# EAGLE design MTRduino_rev5.2 (EAGLE 7.2.0)
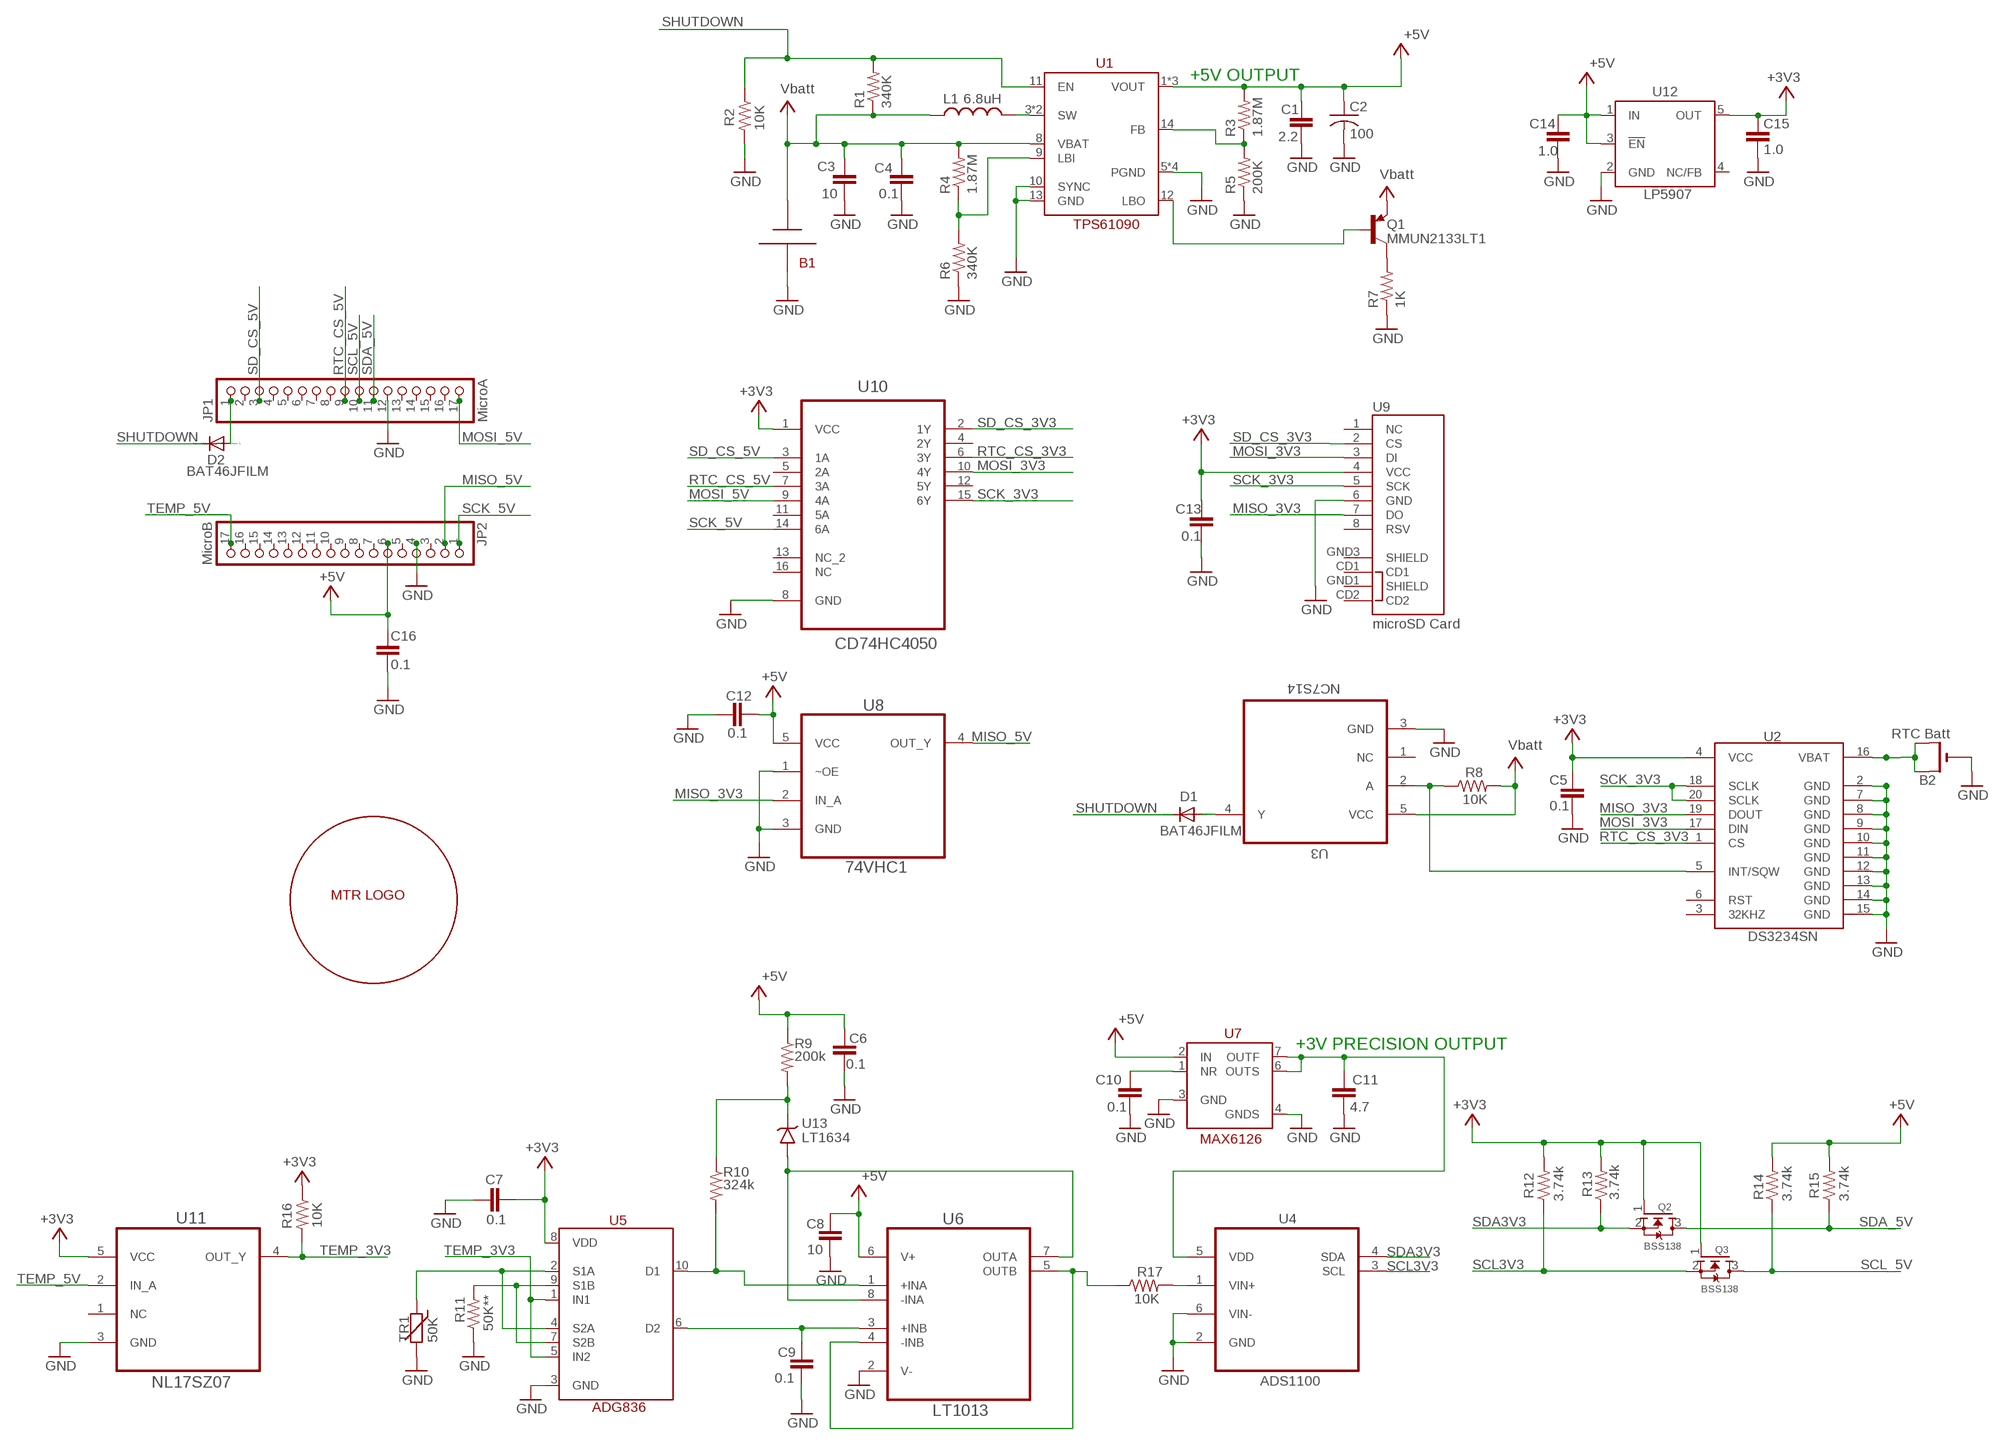
[diagram p0: schematic, sheet 1]

## Parts
B1  2x AA BATT  BATT_AA2  [BATT_AA2]
B2  RTC Batt  CR1220SMT  [CR1220-SMD]
C1  2.2  C-EUC0603  [C0603]
C2  100  C-USC1206K  [C1206K]
C3  10  C-EUC0603  [C0603]
C4  0.1  C-EUC0603  [C0603]
C5  0.1  C-EUC0603  [C0603]
C6  0.1  C-EUC0603  [C0603]
C7  0.1  C-EUC0603  [C0603]
C8  10  C-EUC0603  [C0603]
C9  0.1  C-EUC0603  [C0603]
C10  0.1  C-EUC0603  [C0603]
C11  4.7  C-EUC0603  [C0603]
C12  0.1  C-EUC0603  [C0603]
C13  0.1  C-EUC0603  [C0603]
C14  1.0  C-EUC0603  [C0603]
C15  1.0  C-EUC0603  [C0603]
C16  0.1  C-EUC0603  [C0603]
D1  BAT46JFILM  DIODE-SOD323-R  [SOD323-R]
D2  BAT46JFILM  DIODE-SOD323-R  [SOD323-R]
JP1  MicroA  PINHD-1X17  [1X17]
JP2  MicroB  PINHD-1X17  [1X17]
L1  6.8uH  L-USVLC6045  [VLC6045]
Q1  MMUN2133LT1  MMUN2111LT1  [SC59-BEC]
Q2  BSS138  MOSFET-NREFLOW  [SOT23]
Q3  BSS138  MOSFET-NREFLOW  [SOT23]
R1  340K  R-US_R0603  [R0603]
R2  10K  R-US_R0603  [R0603]
R3  1.87M  R-US_R0805  [R0805]
R4  1.87M  R-US_R0805  [R0805]
R5  200K  R-US_R0603  [R0603]
R6  340K  R-US_R0603  [R0603]
R7  1K  R-US_R0603  [R0603]
R8  10K  R-US_R0603  [R0603]
R9  200k  R-US_R1206  [R1206]
R10  324k  R-US_R1206  [R1206]
R11  50K**  R-US_R2010  [R2010]
R12  3.74k  R-US_R0603  [R0603]
R13  3.74k  R-US_R0603  [R0603]
R14  3.74k  R-US_R0603  [R0603]
R15  3.74k  R-US_R0603  [R0603]
R16  10K  R-US_R0603  [R0603]
R17  10K  R-US_R0603  [R0603]
TR1  50K  THERMISTOR_R-5  [R-5]
U1  TPS61090  TPS61090RSAR  [QFN16-4X4]
U2  DS3234SN  DS3234  [DS3234]
U3  NC7S14  1P1G14MDBVREPG4  [SOT95P280X145-5N]
U4  ADS1100  ADS1100A0IDBVT  [SOT95P280X145-6N]
U5  ADG836  [MSOP10]
U6  LT1013  LT1013DS8PBF  [SOIC127P600X175-8N]
U7  MAX6126  [SOIC127P600X175-8N]
U8  74VHC1  M74VHC1GT125DF1G  [SOT65P210X110-5N]
U9  microSD Card  USD-SOCKET  [MICROSD_1:1]
U10  CD74HC4050  M74HC4050RM13TR  [SOIC127P600X175-16N]
U11  NL17SZ07  NL17SZ07DFT2G  [SOT65P210X110-5N]
U12  LP5907  TPS77030  [SOT23-DBV]
U13  LT1634  LT1634BIS8-1.25  [S8]
U$1  MTRLOGO  [MTRLOGO]

## Nets
+3V3: C5.1 C7.2 C13.1 C15.1 Q2.1(G) Q3.1(G) R12.2 R13.2 R16.1 U2.4(VCC) U5.8(VDD) U9.4(VCC) U10.1(VCC) U11.5(VCC) U12.5(OUT)
+5V: C1.1 C2.1 C6.2 C8.2 C12.1 C14.1 C16.1 JP2.6 R3.2 R9.1 R14.2 R15.2 U1.1(VOUT) U1.15(VOUT) U1.16(VOUT) U6.6(V+) U7.2(IN) U8.5(VCC) U12.1(IN) U12.3(!EN)
GND: B1.-(+) B2.- C1.2 C2.2 C3.2 C4.2 C5.2 C6.1 C7.1 C8.1 C9.1 C10.2 C11.2 C12.2 C13.2 C14.2 C15.2 C16.2 JP1.12 JP2.4 R2.2 R5.1 R6.1 R7.1 R11.1 TR1.2 U1.5(PGND) U1.6(PGND) U1.7(PGND) U1.10(SYNC) U1.13(GND) U1.EXP(PGND) U2.2(GND) U2.7(GND) U2.8(GND) U2.9(GND) U2.10(GND) U2.11(GND) U2.12(GND) U2.13(GND) U2.14(GND) U2.15(GND) U3.3(GND) U4.2(GND) U4.6(VIN-) U5.3(GND) U6.2(V-) U7.3(GND) U7.4(GNDS) U8.1(~OE) U8.3(GND) U9.6(GND) U10.8(GND) U11.3(GND) U12.2(GND)
MISO_3V3: U2.19(DOUT) U8.2(IN_A) U9.7(DO)
MISO_5V: JP2.2 U8.4(OUT_Y)
MOSI_3V3: U2.17(DIN) U9.3(DI) U10.10(4Y)
MOSI_5V: JP1.17 U10.9(4A)
N$1: D1.A U3.4(Y)
N$2: C9.2 U5.6(D2) U6.3(+INB)
N$3: R17.2 U4.1(VIN+)
N$4: C10.1 U7.1(NR)
N$5: R17.1 U6.4(-INB) U6.5(OUTB)
N$6: B2.+$1(+) B2.+$2(+1) U2.16(VBAT)
N$7: L1.P$3 U1.3(SW) U1.4(SW)
N$8: R9.2 R10.1 U13.6(VOUT)
N$9: TR1.1 U5.2(S1A) U5.4(S2A)
N$10: R11.2 U5.7(S2B) U5.9(S1B)
N$11: R4.1 R6.2 U1.9(LBI)
N$12: Q1.C R7.2
N$13: R3.1 R5.2 U1.14(FB)
N$14: U6.7(OUTA) U6.8(-INA) U13.4(GND)
N$16: R10.2 U5.10(D1) U6.1(+INA)
N$17: R8.1 U2.5(INT/SQW) U3.2(A)
N$19: Q1.B U1.12(LBO)
N$21: D2.A JP1.1
N$38: C11.1 U4.5(VDD) U7.6(OUTS) U7.7(OUTF)
RTC_CS_3V3: U2.1(CS) U10.6(3Y)
RTC_CS_5V: JP1.9 U10.7(3A)
SCK_3V3: U2.18(SCLK) U2.20(SCLK) U9.5(SCK) U10.15(6Y)
SCK_5V: JP2.1 U10.14(6A)
SCL3V3: Q3.2(S) R12.1 U4.3(SCL)
SCL_5V: JP1.10 Q3.3(D) R14.1
SD_CS_3V3: U9.2(CS) U10.2(1Y)
SD_CS_5V: JP1.3 U10.3(1A)
SDA3V3: Q2.2(S) R13.1 U4.4(SDA)
SDA_5V: JP1.11 Q2.3(D) R15.1
SHUTDOWN: D1.C D2.C R1.2 R2.1 U1.11(EN)
TEMP_3V3: R16.2 U5.1(IN1) U5.5(IN2) U11.4(OUT_Y)
TEMP_5V: JP2.17 U11.2(IN_A)
V+: B1.+(-) C3.1 C4.1 L1.P$2 Q1.E R1.1 R4.2 R8.2 U1.8(VBAT) U3.5(VCC) ; supply symbol labelled Vbatt
Unconnected: JP1.2 JP1.4 JP1.5 JP1.6 JP1.7 JP1.8 JP1.13 JP1.14 JP1.15 JP1.16 JP2.3 JP2.5 JP2.7 JP2.8 JP2.9 JP2.10 JP2.11 JP2.12 JP2.13 JP2.14 JP2.15 JP2.16 U2.3(32KHZ) U2.6(RST) U3.1(NC) U9.1(NC) U9.8(RSV) U9.CD1 U9.CD2 U9.GND1(SHIELD) U9.GND3(SHIELD) U10.4(2Y) U10.5(2A) U10.11(5A) U10.12(5Y) U10.13(NC_2) U10.16(NC) U11.1(NC) U12.4(NC/FB)

## Notes on the sheet
- +5V OUTPUT
- +3V PRECISION OUTPUT

## Library data of the parts
B1 = adafruit:BATT_AA2
B2 = adafruit:CR1220: CR1216/CR1220/CR1225 12mm 3V lithium coin cell Great for battery packup. Both SMT and THM holders. Note the THM package has the ground pads on both sides of the PCB so that the masks are the same - this reduces the cost
C1 C3-C16 = rcl:C-EU: CAPACITOR, European symbol
C2 = resistor:C-US: CAPACITOR, American symbol
D1 D2 = diode:DIODE-: DIODE
JP1 JP2 = pinhead:PINHD-1X17: PIN HEADER
L1 = resistor:L-US: INDUCTOR, American symbol
Q1 = transistor-pnp:MMUN2111*: PNP Transistror
Q2 Q3 = adafruit:MOSFET-N: N-Channel Mosfet 2N7002E - 60V 260mA SOT23 [Digikey: 2N7002ET1GOSTR-ND] - REEL BSH103 - 30V 850mA SOT23 [Digikey: 568-5013-1-ND]
R1-R17 = resistor:R-US_: RESISTOR, American symbol
TR1 = discrete:THERMISTOR_: Thermo Resistor
U1 = microchip:TPS61090RSAR
U2 = SparkFun-FreqCtrl:DS3234: SPI RTC module with battery backup and internal clock.
U3 = Texas Instruments_By_element14_Batch_1:1P1G14MDBVREPG4: SINGLE SCHMITT-TRIGGER INVERTER; MPN: 1P1G14MDBVREPG4; OC_FARNELL: -; OC_NEWARK: 56P2415; PACKAGE: SOT-23-5; SUPPLIER: Texas Instruments
U4 = Texas Instruments_By_element14_Batch_1:ADS1100A0IDBVT: Self-Calibrating, 16-Bit ANALOG-TO-DIGITAL CONVERTER; MPN: ADS1100A0IDBVT; OC_FARNELL: 1135959; OC_NEWARK: 20H0708; PACKAGE: SOT-23-6; SUPPLIER: Texas Instruments
U5 = analog-devices:ADG836
U6 = LTC_By_element14_Batch_1:LT1013DS8PBF: Dual Precision Op Amp; MPN: LT1013DS8#PBF; OC_FARNELL: 9559302; OC_NEWARK: 57M0827; PACKAGE: SOIC-8; SUPPLIER: LINEAR TECHNOLOGY
U7 = Maxim_By_element14_Batch_1:MAX6126
U8 = ON Semiconductor_By_element14_Batch_1:M74VHC1GT125DF1G: Noninverting Buffer / CMOS Logic Level Shifter; MPN: M74VHC1GT125DF1G; OC_FARNELL: 1567363; OC_NEWARK: 83H7591; PACKAGE: SOT-23-5; SUPPLIER: ON SEMICONDUCTOR
U9 = SparkFun-Connectors:USD-SOCKET: microSD Socket Push-push type uSD socket. Schematic element and footprint production proven. Spark Fun Electronics SKU : PRT-00127. tDoc lines correctly indicate media card edge positions when inserting (unlocked, locked, depressed). NOTE: CD1 and CD2 are connected internally; PROD_ID: CONN-07820
U10 = ST Microelctronics_By_element14_Batch_1:M74HC4050RM13TR: HEX BUFFER/CONVERTER; MPN: M74HC4050RM13TR; OC_FARNELL: 1261257; OC_NEWARK: 89K0905; PACKAGE: SOIC-16; SUPPLIER: STMICROELECTRONICS
U11 = ON Semiconductor_By_element14_Batch_1:NL17SZ07DFT2G: Single Non-Inverting Buffer with Open Drain Output; MPN: NL17SZ07DFT2G; OC_FARNELL: 1705431; OC_NEWARK: 04R7799; PACKAGE: SOT-353-5; SUPPLIER: ON Semiconductor
U12 = texas:TPS770*: ULTRALOW-POWER 50-mA LOW-DROPOUT LINEAR REGULATORS 50-mA Low-Dropout Regulator Source: http://focus.ti.com/lit/ds/symlink/tps77001.pdf; MF: TEXAS INSTRUMENTS; MPN: TPS77030DBVT; OC_FARNELL: 1207348; OC_NEWARK: 77C1185
U13 = linear-technology:LT1634: Micropower Precision Shunt Voltage Reference Source: Darta sheet <http://cds.linear.com/docs/en/datasheet/1634fe.pdf>
U$1 = SparkFun-Passives:MTRLOGO

## Board
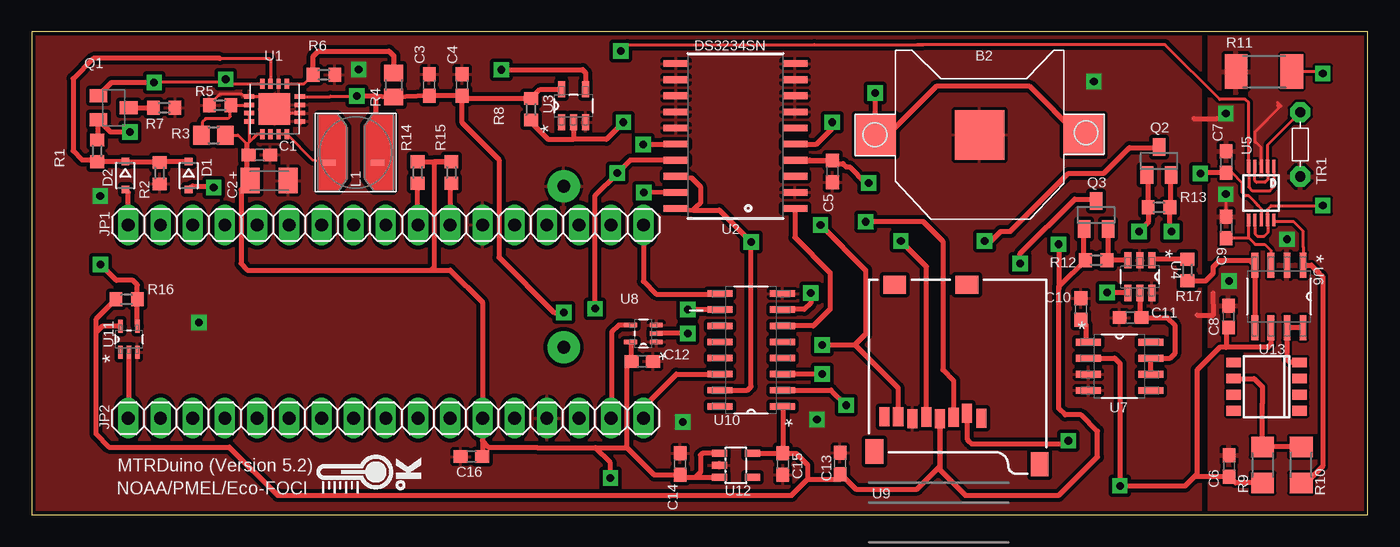
[diagram p1: board, top side]
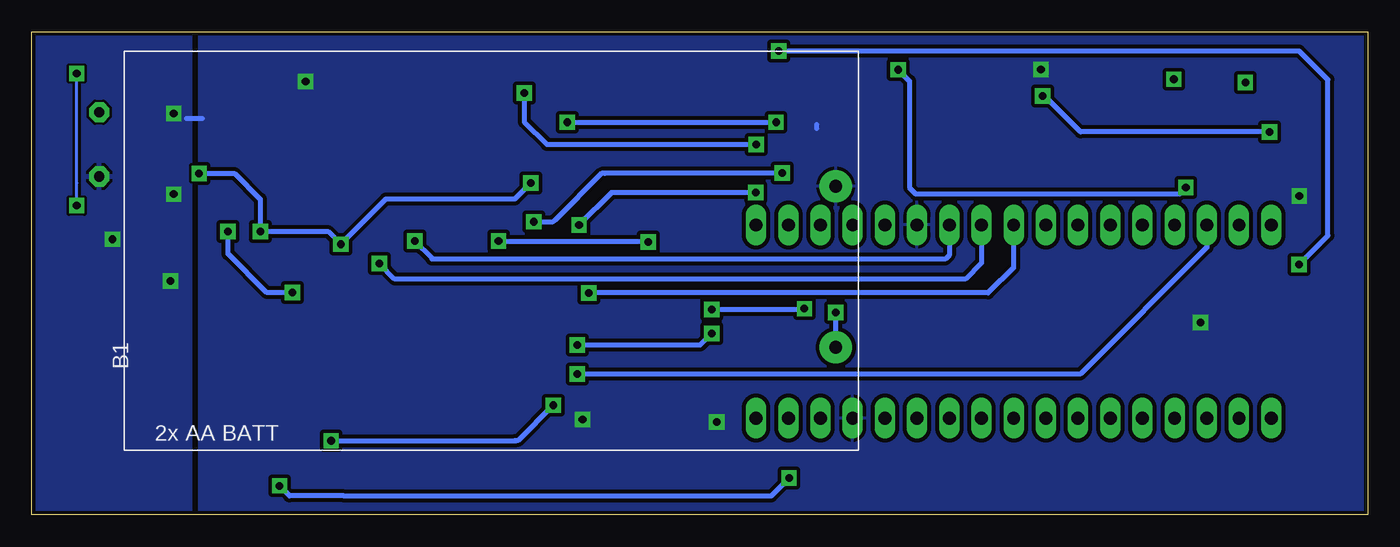
[diagram p2: board, bottom side, seen from below]

Size 105.41 x 38.1 mm. Coordinates in mm from the lower left corner, seen from the top.
Outline: 0,0 105.41,0 105.41,38.1 0,38.1 0,0
Copper layers (1*16): Top 0.035mm / dielectric 1.5mm / Bottom 0.035mm
Design rules "default *": minimum track width 8mil, minimum drill 20mil, track to track 8mil, track to pad 8mil, pad to pad 8mil, via to via 10mil, smd to smd 8mil, copper to edge 12mil, drill to drill 12mil, minimum pad ring 12mil, minimum via ring 12mil, stop-mask expansion 4mil, vias tented up to drill 0mil, thermal gap 10mil

### Footprints (pad centres in the part's own frame; a part is rotated, then mirrored left to right if it is on the bottom)
BATT_AA2 = drill 1 pad 2.54: + -27.178,7.62; - -27.178,-5.08
CR1220-SMD = smd 3.2 x 3.2: +$1 -8.2,0; +$2 8.2,0 | smd 3.9 x 3.9: - 0,0
C0603 = smd 1.1 x 1: 1 -0.85,0; 2 0.85,0
C1206K = smd 1.5 x 2: 1 -1.5,0; 2 1.5,0
SOD323-R = smd 0.6 x 0.6: A 1.1,0; C -1.1,0
1X17 = drill 1.016 long: 1 -20.32,0; 2 -17.78,0; 3 -15.24,0; 4 -12.7,0; 5 -10.16,0; 6 -7.62,0; 7 -5.08,0; 8 -2.54,0; 9 0,0; 10 2.54,0; 11 5.08,0; 12 7.62,0; 13 10.16,0; 14 12.7,0; 15 15.24,0; 16 17.78,0; 17 20.32,0
VLC6045 = smd 1.016 x 0.508: P$2 1.27,3.81; P$3 5.08,3.81
SC59-BEC = smd 1 x 1.4: B -0.95,-1.2; C 0,1.2; E 0.95,-1.2
SOT23 = smd 1 x 1.4: 1 -0.95,-1.1; 2 0.95,-1.1; 3 0,1.1
R0603 = smd 1 x 1.1: 1 -0.85,0; 2 0.85,0
R0805 = smd 1.3 x 1.5: 1 -0.95,0; 2 0.95,0
R1206 = smd 1.6 x 1.803: 1 -1.422,0; 2 1.422,0
R2010 = smd 1.8 x 2.7: 1 -2.2,0; 2 2.2,0
R-5 = drill 0.813 pad 1.6 octagon: 1 -2.54,0; 2 2.54,0
QFN16-4X4 = smd 0.8 x 0.35: 1 -2,0.975; 2 -2,0.325; 3 -2,-0.325; 4 -2,-0.975; 9 2,-0.975; 10 2,-0.325; 11 2,0.325; 12 2,0.975 | smd 0.35 x 0.8: 5 -0.975,-2; 6 -0.325,-2; 7 0.325,-2; 8 0.975,-2; 13 0.975,2; 14 0.325,2; 15 -0.325,2; 16 -0.975,2 | smd 2.5 x 2.5: EXP 0,0
DS3234 = smd 0.53 x 1.98: 1 -5.715,-4.685; 2 -4.445,-4.685; 3 -3.175,-4.685; 4 -1.905,-4.685; 5 -0.635,-4.685; 6 0.635,-4.685; 7 1.905,-4.685; 8 3.175,-4.685; 9 4.445,-4.685; 10 5.715,-4.685; 11 5.715,4.685; 12 4.445,4.685; 13 3.175,4.685; 14 1.905,4.685; 15 0.635,4.685; 16 -0.635,4.685; 17 -1.905,4.685; 18 -3.175,4.685; 19 -4.445,4.685; 20 -5.715,4.685
SOT95P280X145-5N = smd 1.27 x 0.559: 1 -1.295,0.94; 2 -1.295,0; 3 -1.295,-0.94; 4 1.295,-0.94; 5 1.295,0.94
SOT95P280X145-6N = smd 1.27 x 0.559: 1 -1.295,0.94; 2 -1.295,0; 3 -1.295,-0.94; 4 1.295,-0.94; 5 1.295,0; 6 1.295,0.94
MSOP10 = smd 0.25 x 1: 1 -1,-2.113; 2 -0.5,-2.113; 3 0,-2.113; 4 0.5,-2.113; 5 1,-2.113; 6 1,2.113; 7 0.5,2.113; 8 0,2.113; 9 -0.5,2.113; 10 -1,2.113
SOIC127P600X175-8N = smd 1.981 x 0.533: 1 -2.464,1.905; 2 -2.464,0.635; 3 -2.464,-0.635; 4 -2.464,-1.905; 5 2.464,-1.905; 6 2.464,-0.635; 7 2.464,0.635; 8 2.464,1.905
SOT65P210X110-5N = smd 1.016 x 0.356: 1 -1.016,0.66; 2 -1.016,0; 3 -1.016,-0.66; 4 1.016,-0.66; 5 1.016,0.66
MICROSD_1:1 = smd 0.8 x 1.5: 1 5.096,10.919; 2 6.218,10.519; 3 7.274,10.853; 4 8.367,10.982; 5 9.421,10.828; 6 10.539,10.973; 7 11.648,10.819; 8 12.721,10.819 | smd 1.8 x 1.4: CD1 11.92,0.4; CD2 6.22,0.4 | smd 1.4 x 1.9: GND1 0.497,14.55; GND3 13.52,13.55
SOIC127P600X175-16N = smd 1.981 x 0.508: 1 -2.464,4.445; 2 -2.464,3.175; 3 -2.464,1.905; 4 -2.464,0.635; 5 -2.464,-0.635; 6 -2.464,-1.905; 7 -2.464,-3.175; 8 -2.464,-4.445; 9 2.464,-4.445; 10 2.464,-3.175; 11 2.464,-1.905; 12 2.464,-0.635; 13 2.464,0.635; 14 2.464,1.905; 15 2.464,3.175; 16 2.464,4.445
SOT23-DBV = smd 0.55 x 1.2: 1 -0.95,-1.3; 2 0,-1.3; 3 0.95,-1.3; 4 0.95,1.3; 5 -0.95,1.3
S8 = smd 0.762 x 1.143: 1 -1.905,-2.6; 2 -0.635,-2.6; 3 0.635,-2.6; 4 1.905,-2.6; 5 1.905,2.6; 6 0.635,2.6; 7 -0.635,2.6; 8 -1.905,2.6

### Placement (x,y rotation side)
B1  69.15,20.83 180 bottom
B2  74.78,29.97 0 top
C1  17.98,28.39 0 top
C2  18.73,26.36 0 top
C3  31.36,33.9 90 top
C4  33.96,33.9 90 top
C5  63.18,27.09 270 top
C6  94.46,3.86 270 top
C7  94.23,27.81 270 top
C8  94.41,15.62 270 top
C9  94.23,22.66 270 top
C10  82.78,16.22 90 top
C11  86.68,15.56 180 top
C12  48.16,12.1 0 top
C13  63.78,4.05 90 top
C14  51.16,4 90 top
C15  59.26,4 270 top
C16  34.7,4.6 180 top
D1  12.39,26.75 270 top
D2  7.38,26.75 270 top
JP1  27.94,22.86 0 top
JP2  27.94,7.62 180 top
L1  28.56,31.57 180 top
Q1  6.46,32.1 270 top
Q2  88.93,27.91 0 top
Q3  83.97,23.64 0 top
R1  5.16,28.7 270 top
R2  10.09,26.94 270 top
R3  14.35,29.95 0 top
R4  28.56,33.9 270 top
R5  14.86,32.3 0 top
R6  23.06,34.7 180 top
R7  10.46,32.1 180 top
R8  39.38,31.98 90 top
R9  97.1,3.94 90 top
R10  100.15,3.94 270 top
R11  97.21,34.96 0 top
R12  83.97,20.09 180 top
R13  88.93,24.25 180 top
R14  30.45,27 90 top
R15  33.11,27 90 top
R16  7.49,16.99 0 top
R17  91.19,19.3 90 top
TR1  100.08,29.21 270 top
U1  19.16,32 90 top
U2  55.52,29.87 90 top
U3  42.75,32.26 90 top
U4  87.42,18.79 270 top
U5  97,25.37 180 top
U6  98.4,17.22 270 top
U7  85.82,11.71 0 top
U8  48.26,14.3 180 top
U9  80.01,18.54 180 top
U10  56.76,13 180 top
U11  7.67,13.84 90 top
U12  55.56,3.9 270 top
U13  97.43,10.11 90 top
U$1  30.99,1.52 90 top

### Tracks (layer width: path | path; a pad name or v marks a point on that pad's centre or on a via)
+3V3  (via drill 0.6)
  Top 0.254: U5.8 97,24.16 96.77,24.38 96.52,24.64 96.01,25.15 95.76,25.15 95.5,25.4 95.5,26.16 94.7,26.96 C7.2
  Top 0.406: U10.1 59.26,8.52 C15.1 | U2.4 60.14,27.87 60.21,27.94 63.25,27.94 63.5,27.69 64.01,27.69 64.26,27.43 64.52,27.43 65.79,26.16 v66.04,26.16 | U12.5 C15.1 | C15.1 60.31,4.85 61.21,3.95 61.21,2.79 | 60.13,27.86 U2.4 | U11.5 5.56,14.86 5.05,14.35 | 5.05,14.35 5.05,6.38 6.1,5.33 15.6,5.33 19.41,1.52 59.94,1.52 61.21,2.79 | 60.14,27.87 U2.4 | R16.1 5.05,15.4 5.05,14.35 | U2.4 61.37,27.96 63.15,27.96 C5.1 | 61.21,2.79 63.78,2.79 C13.1 63.85,3.2 65.02,2.03 69.85,2.03 71.37,3.56 71.64,3.83 U9.4 71.64,3.54 73.66,1.52 81.03,1.52 84.07,4.57 84.07,6.6 82.8,7.87 81.53,7.87 81.03,8.38 81.03,16.51 81.03,17.78 | 81.03,17.78 81.03,17.99 81.17,18.14 R12.2 83.02,20.19 Q3.1 | Q2.1 88.08,26.71 R13.2 88.08,23.06 v87.38,22.35 | C7.2 92.24,26.96 v92.2,26.92 | v81.03,21.34 81.03,17.78
  Bottom 0.406: v92.2,26.92 89.41,26.92 87.38,24.89 v87.38,22.35 82.04,22.35 v81.03,21.34 77.47,24.89 76.96,24.89 75.69,24.89 67.31,24.89 v66.04,26.16
+5V  (via drill 0.6)
  Top 0.254: 17.81,30 U1.1 17.81,30 | 17.81,30 17.76,30 17.16,29.4 | U1.15 U1.16 17.16,29.4 | 17.16,29.4 16.96,29.2 | 17.81,30 17.02,29.21 | 17.02,29.21 17.02,26.42 | R3.2 16.28,29.95 17.02,29.21
  Top 0.406: 16.96,29.2 16.96,28.05 | 52.36,2.95 51.36,2.95 C14.1 49.11,3.15 46.96,5.3 | 52.36,2.95 U12.3 | 46.96,5.3 46.96,11.85 47.06,11.85 C12.1 47.31,13.57 U8.5 | 44.46,5.3 46.96,5.3 | U12.1 52.91,4.85 52.76,4.7 52.76,3.35 52.36,2.95 | C1.1 16.96,28.05 | v45.66,2.9 45.66,4.1 44.46,5.3 | 44.46,5.3 39.86,5.3 36.1,5.3 35.56,5.84 | 16.96,28.05 16.96,26.47 C2.1 | R14.2 31.75,27.85 R15.2 31.76,27.85 31.75,27.84 31.75,19.56 31.5,19.3 | 17.02,26.42 16.51,25.65 16.51,19.81 17.02,19.3 31.5,19.3 | U6.6 97.77,13.44 97.54,13.21 94.23,13.21 | 94.23,13.21 93.73,13.21 93.47,12.95 91.95,11.43 91.95,3.23 91.61,2.88 | C8.2 94.23,14.59 94.23,13.21 | 31.5,19.3 33.02,19.3 35.56,16.76 JP2.6 35.56,5.84 | 35.56,5.84 C16.1 | U7.2 85.44,12.35 85.85,11.94 v85.85,2.29 91.01,2.29 91.61,2.88 | R9.1 94.96,2.52 C6.2 91.73,3.01 91.61,2.88
  Bottom 0.406: v45.66,2.9 47.06,1.5 80.78,1.5 85.07,1.5 v85.85,2.29
GND  (via drill 0.6)
  Top 0.254: U1.6 19.48,31.68 U1.EXP 18.18,32.98 U1.13 16.79,32.98 16.56,33.2 14.86,33.2 13.96,32.3 13.86,32.4 13.91,32.4 R5.1 | C9.1 94.23,24.64 | U5.3 97,28.93 96.52,29.41 96.52,30.23 98.55,32.26 98.3,32.51 98.3,32.26
  Top 0.406: U1.5 21.16,30.9 | 93.19,17.49 93.22,15.75 91.95,15.75 | 91.69,31.24 93.47,31.24
  Bottom 0.406: 43.5,30.8 43.5,30.48 | 91.95,31.24 93.22,31.24
  other vias: 13.2,15.18 5.4,25.15 25.79,35.13 51.36,7.33 61.95,7.51 99.03,21.73 83.79,34.18 94.21,25.29 94.46,18.43 94.21,31.64
  pour Top (isolate 0.305): -1.96,39.55 92.2,39.29 92.2,-0.36 -1.93,-0.36 -1.93,39.42
  pour Bottom (isolate 0.305): -1.96,39.55 92.2,39.55 92.2,-0.36 -1.93,-0.36 -1.93,39.42
  pour Top: 92.96,38.86 92.96,-0.51 107.44,-0.51 107.44,38.86
  pour Bottom: 92.96,38.86 92.96,-0.51 107.44,-0.51 107.44,38.86
MISO_3V3  (via drill 0.6)
  Top 0.406: v62.36,13.4 64.96,13.4 | v51.76,14.3 U8.2 | U2.19 v48.29,25.41 48.26,25.41 | v62.23,22.86 65.79,19.3 65.79,14.22 64.96,13.4 | U9.7 68.36,10 64.96,13.4
  Bottom 0.406: v62.36,13.4 52.66,13.4 v51.76,14.3 | v48.29,25.41 59.68,25.41 v62.23,22.86
MISO_5V
  Top 0.406: U8.4 46.32,14.96 45.76,14.4 45.76,7.66 JP2.2
MOSI_3V3  (via drill 0.6)
  Top 0.406: U10.10 51.78,16.18 v51.76,16.2 | U2.17 47.22,27.96 v46.2,26.95 44.45,25.2 v44.45,16.26 | U9.3 72.74,10.58 71.88,11.43 71.88,21.59 70.36,23.11 v65.79,23.11
  Bottom 0.406: v46.2,26.95 60.2,26.92 60.45,26.92 64.14,23.24 | 64.14,23.24 64.26,23.11 | v51.76,16.2 44.51,16.2 v44.45,16.26 | v65.79,23.11 64.26,23.11 | 64.26,23.11 64.14,23.24
MOSI_5V
  Top 0.406: JP1.17 48.26,18.4 49.26,17.4 54.25,17.4 U10.9
N$1  (via drill 0.6)
  Top 0.406: U3.4 43.71,33.58 43.71,34.85 43.46,35.1 v37.06,35.1 | v14.36,25.8 14.26,25.9 12.8,25.9 12.64,25.9 D1.A
  Bottom 0.406: v14.36,25.8 14.86,25.3 35.66,25.3 36.16,25.8 36.16,34.2 v37.06,35.1
N$2
  Top 0.254: 96.01,21.84 96.01,22.86 | 96.01,22.86 96.01,23.25 | 96.01,21.84 96.52,21.34 97.28,21.34 97.77,20.85 U6.3 | C9.2 94.27,21.84 96.01,21.84 | 96.01,23.25 96.01,22.86 | 96.01,22.86 96.01,23.25 | 96.01,23.25 U5.6
N$3
  Top 0.406: R17.2 88.43,20.15 U4.1
N$4
  Top 0.406: U7.1 83.19,13.79 83.19,14.96 C10.1
N$5
  Top 0.406: U6.5 U6.4 96.11,20.07 93.73,20.07 93.22,19.56 93.22,19.05 92.62,18.45 R17.1
N$6  (via drill 0.6)
  Top 0.406: B2.+$2 82.56,29.97 78.74,33.78 71.37,33.78 68.07,30.48 67.1,30.48 B2.+$1 66.58,33.24 v66.55,33.27 | v48.26,29.21 50.81,29.21 U2.16
  Bottom 0.406: v66.55,33.27 66.55,30.99 64.77,29.21 v48.26,29.21
N$7
  Top 0.254: U1.3 U1.4 22.12,28.02 L1.P$3
N$8
  Top 0.406: U13.6 95.17,10.74 96.44,10.74 96.77,10.41 97.1,10.08 97.1,8.81 R9.2 R10.1
N$9
  Top 0.254: U5.4 96.5,26.36 96.65,26.21 97.3,26.21 97.5,26.42 | 97.5,26.42 U5.2 97.5,29.18 TR1.1 | 97.5,26.42 97.48,26.42
N$10  (via drill 0.6)
  Top 0.254: U5.7 96.5,22.17 96.7,21.97 97.23,21.97 97.5,22.24 U5.9 97.5,24.1 97.79,24.38 v101.85,24.38 | v101.85,34.8 101.69,34.96 R11.2
  Bottom 0.254: v101.85,24.38 101.85,26.16 v101.85,34.8
N$11
  Top 0.254: U1.9 21.51,34 R6.2
  Top 0.406: R6.2 22.21,36.18 22.61,36.58 28.19,36.58 28.56,36.21 R4.1
N$12
  Top 0.406: Q1.C R7.2
N$13
  Top 0.254: U1.14 17.14,32.3 R5.2 15.66,32.25 15.66,31.41 15.49,31.24 13.72,31.24 13.46,30.99 13.46,30.26 R3.1
N$14
  Top 0.406: U6.8 U6.7 99.03,12.25 99.27,12.01 U13.4
N$16
  Top 0.254: U6.1 100.31,21.11 100.31,22.38 99.57,23.11 98.15,23.11 U5.10
  Top 0.406: U6.1 100.97,19.68 101.6,19.05 101.85,18.8 101.85,3.81 100.56,2.52 R10.2
N$17  (via drill 0.6)
  Top 0.406: 42.67,29.62 40.74,29.62 39.38,30.98 R8.1 | U3.2 42.75,29.69 42.67,29.62 | v46.69,30.96 45.34,29.62 42.67,29.62 | U2.5 61.92,29.23 63.14,30.45 v63.14,30.96
  Bottom 0.406: v63.14,30.96 v46.69,30.96
N$19  (via drill 0.6)
  Top 0.254: U1.12 15.66,34 v15.31,34.35 15.05,34.1 v9.66,34.1
  Top 0.406: Q1.B 6.31,34.1 v9.66,34.1
N$21
  Top 0.406: JP1.1 7.62,25.42 D2.A
N$38
  Top 0.406: U7.6 U7.7 89.82,12.35 90.17,12.7 90.17,14.99 89.6,15.56 C11.1 87.42,15.66 U4.5
RTC_CS_3V3
  Top 0.406: U10.6 61.66,14.9 63,16.24 62.99,16.25 62.99,19.1 60.21,21.88 U2.1
RTC_CS_5V  (via drill 0.6)
  Top 0.406: v61.46,17.5 61.46,16.7 60.96,16.2 59.25,16.2 U10.7
  Bottom 0.406: v61.46,17.5 29.96,17.5 27.94,19.52 JP1.9
SCK_3V3  (via drill 0.6)
  Top 0.406: 52.17,24.03 52.4,24.26 52.43,24.26 52.76,24.59 52.76,25.88 52.07,26.57 U2.18 | U10.15 56.48,9.82 56.76,10.1 v56.76,21.52 54.25,24.03 52.17,24.03 | U2.20 52.17,24.03 | U9.5 70.59,19.58 v68.58,21.59
  Bottom 0.406: 56.78,21.5 v56.76,21.52 56.83,21.59 v68.58,21.59
SCK_5V
  Top 0.406: U10.14 50.86,11.1 48.26,8.5 JP2.1
SCL3V3
  Top 0.406: Q3.2 84.92,20.19 R12.1 U4.3
SCL_5V  (via drill 0.6)
  Top 0.406: 30.48,22.3 JP1.10 30.45,22.89 R14.1 | v77.98,19.81 77.98,20.57 82.3,24.89 83.82,24.89 Q3.3
  Bottom 0.406: JP1.10 30.48,19.86 31.75,18.59 75.97,18.59 76.76,18.59 v77.98,19.81
SD_CS_3V3  (via drill 0.6)
  Top 0.406: U9.2 73.79,5.96 73.91,5.84 74.17,5.59 81.53,5.59 v81.79,5.84 | U10.2 63.07,9.82 v64.26,8.64
  Bottom 0.406: v81.79,5.84 67.31,5.84 | 67.31,5.84 67.15,5.84 | v64.26,8.64 67.06,5.84 67.31,5.84
SD_CS_5V  (via drill 0.6)
  Top 0.406: v62.36,11.1 v62.35,11.1 U10.3
  Bottom 0.406: 28.16,11.1 28.7,11.1 | 28.7,11.1 v62.36,11.1 | JP1.3 12.7,21.08 22.61,11.18 22.68,11.1 28.7,11.1
SDA3V3  (via drill 0.6)
  Top 0.406: v89.92,22.35 89.78,22.48 R13.1 89.88,24.35 Q2.2 | U4.4 84.87,17.49 v84.84,17.53
  Bottom 0.406: v89.92,22.35 89.92,20.57 86.87,17.53 v84.84,17.53
SDA_5V  (via drill 0.6)
  Top 0.406: JP1.11 33.06,22.9 33.06,26.15 R15.1 | v75.18,21.59 75.69,21.59 76.45,22.35 76.96,22.35 77.22,22.35 81.79,26.92 84.58,26.92 86.61,28.96 88.88,28.96 Q2.3
  Bottom 0.406: JP1.11 33.02,20.47 33.33,20.17 73.84,20.17 73.84,20.25 v75.18,21.59
SHUTDOWN
  Top 0.254: 14.86,36 18.76,36 18.84,35.92 U1.11
  Top 0.406: 14.86,36 4.86,36 3.26,34.4 3.26,28.7 3.96,28 5.01,28 R1.2 D2.C 7.45,27.79 R2.1 10.15,27.85 D1.C
TEMP_3V3  (via drill 0.6)
  Top 0.254: U5.1 98,25.87 97.69,25.55 96.32,25.55 96,25.87 U5.5 96,32.52 95.76,32.77 93.73,32.77 89.41,37.08 89.15,37.08 69.85,37.08 | v46.48,36.58 46.99,37.08 61.72,37.08 69.85,37.08 | 69.85,37.08 70.36,37.08
  Top 0.406: U11.4 8.34,14.87 R16.2 8.34,18.12 7.98,18.49 6.68,18.49 v5.44,19.74
  Bottom 0.406: v46.48,36.58 5.41,36.58 3.15,34.31 3.15,22.02 v5.44,19.74
TEMP_5V
  Top 0.406: U11.2 7.67,7.67 JP2.17
V+  (via drill 0.6)
  Top 0.254: U1.8 23.54,32.98 23.58,33.02 v25.65,33.02
  Top 0.406: R1.1 5.26,29.65 Q1.E 6.21,30.2 v7.76,30.2 | C4.1 33.96,30.9 36.86,28 36.86,20.3 41.21,15.95 v41.97,15.95 | C4.1 C3.1 R4.2 27.18,33.05 | L1.P$2 27.18,28.13 27.18,33.05 | v25.65,33.02 25.68,33.05 27.18,33.05 | C4.1 34.18,32.83 R8.2 40.11,33.55 U3.5
  Bottom 0.406: v7.76,30.2 22.66,30.2 25.48,33.02 v25.65,33.02 | B1.+ v41.97,15.95

### Text on the board
tNames: + | MTRDuino (Version 5.2) | NOAA/PMEL/Eco-FOCI
tValues: 12 | 11 | 10 | 9 | 8 | 7 | 6 | 5 | 4 | 3 | 2 | RS | RX | TX | SS | GND | MOSI | 13 | 3V | AREF | A0 | A1 | A2 | A3 | A4 | A5 | NC | NC | +5V | RS | VIN | MISO | SCK | GND